# EAGLE design Simon-PTH (EAGLE 5.10)
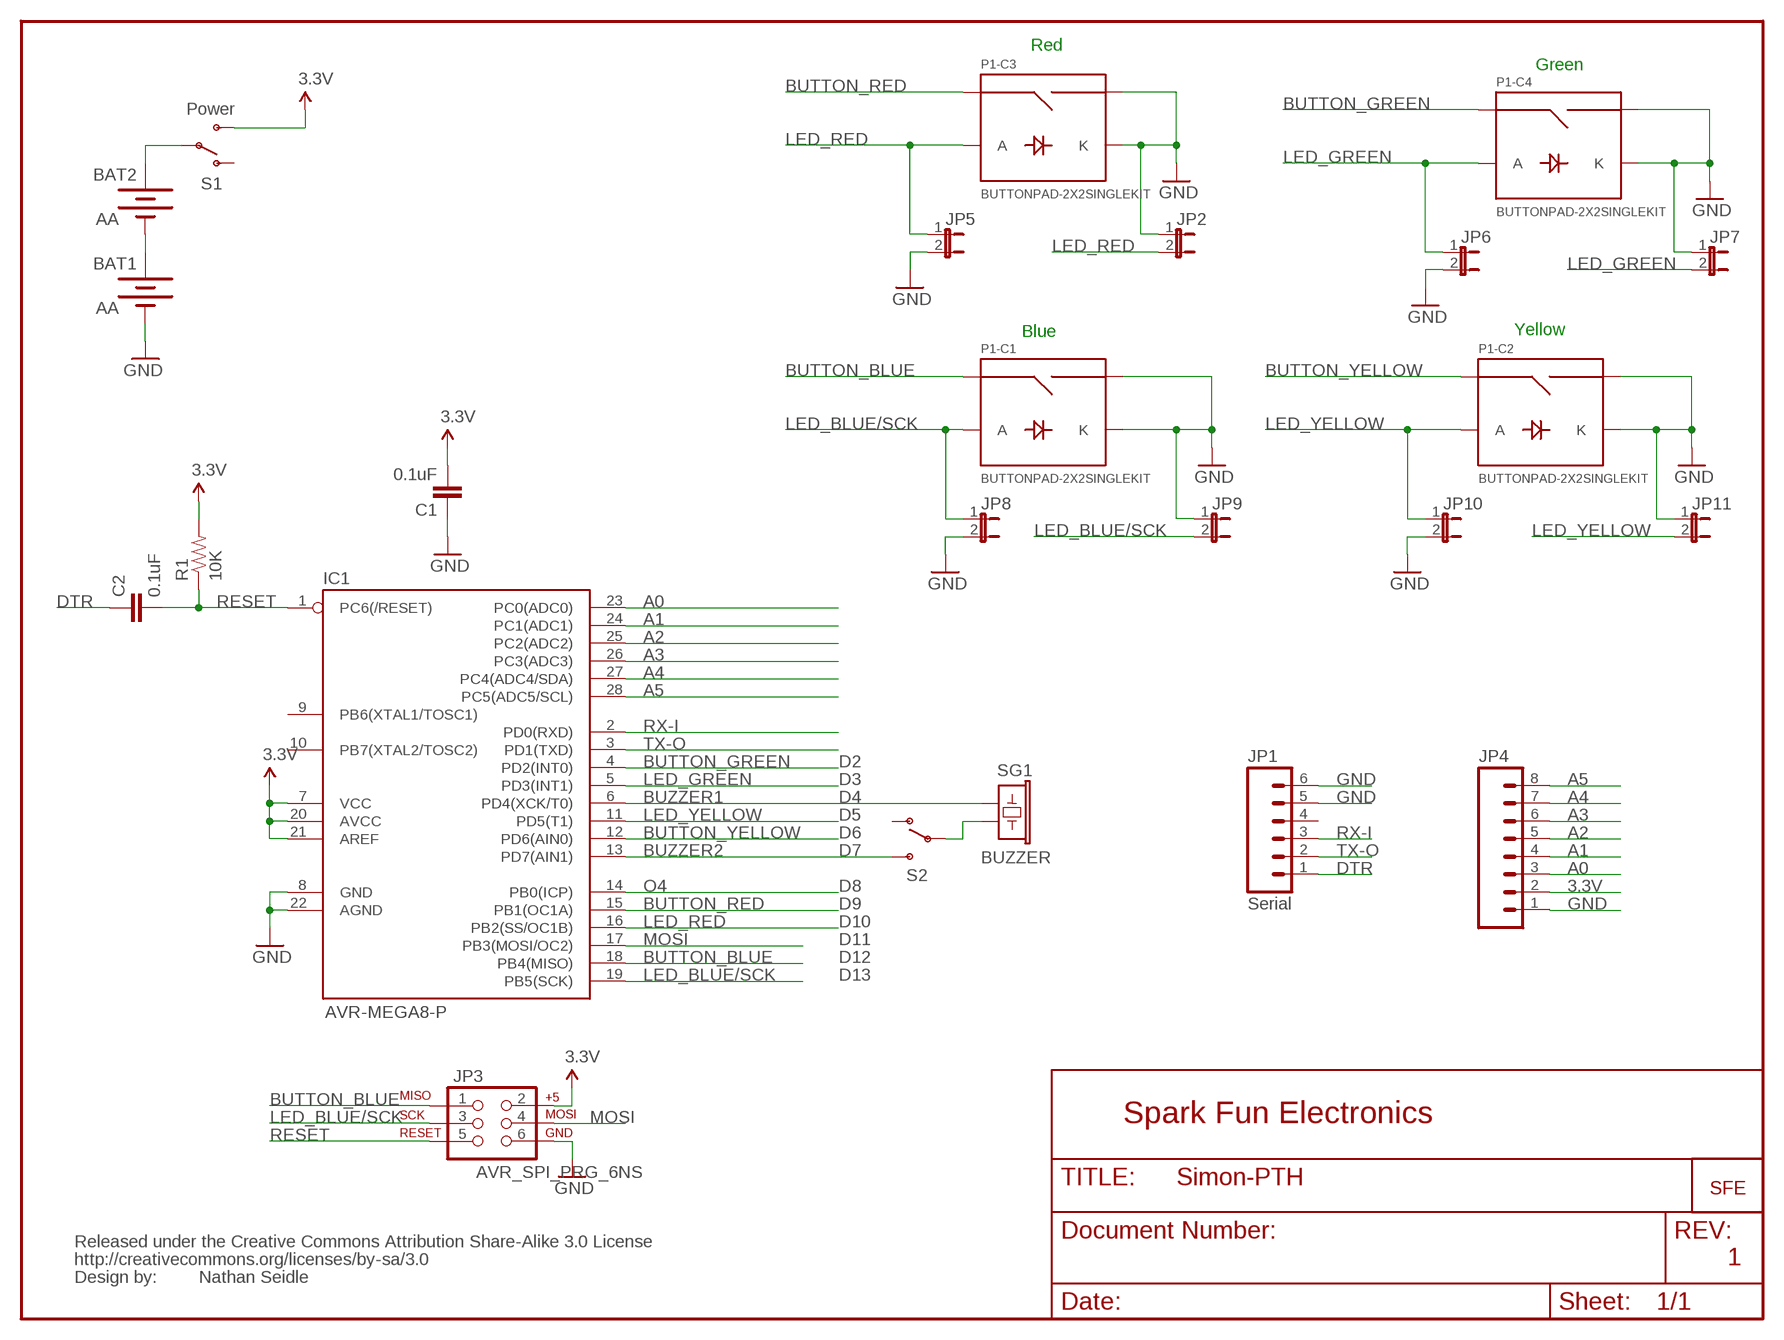
[diagram p0: schematic, sheet 1]

## Parts
BAT1  AA  BATTERYAA-KIT  [BATTERY-AA-KIT]
BAT2  AA  BATTERYAA-KIT  [BATTERY-AA-KIT]
C1  0.1uF  CAPCAP-PTH-SMALL-KIT  [CAP-PTH-SMALL-KIT]
C2  0.1uF  CAPCAP-PTH-SMALL-KIT  [CAP-PTH-SMALL-KIT]
IC1  AVR-MEGA8-P  AVR-MEGA8-PKIT  [DIL28-3-SIMON-KIT]
JP1  Serial  M06-SFENOSILK  [1X06-NOSILK]
JP2  JUMPER-2NOSILK  [SJ_2S_NO_SILK]
JP3  AVR_SPI_PRG_6NS  [2X3-NS]
JP4  M08NOSILK  [1X08NOSILK]
JP5  JUMPER-2NOSILK  [SJ_2S_NO_SILK]
JP6  JUMPER-2NOSILK  [SJ_2S_NO_SILK]
JP7  JUMPER-2NOSILK  [SJ_2S_NO_SILK]
JP8  JUMPER-2NOSILK  [SJ_2S_NO_SILK]
JP9  JUMPER-2NOSILK  [SJ_2S_NO_SILK]
JP10  JUMPER-2NOSILK  [SJ_2S_NO_SILK]
JP11  JUMPER-2NOSILK  [SJ_2S_NO_SILK]
P1-  BUTTONPAD-2X2SINGLEKIT  [BUTTONPAD-2X2SINGLE-KIT]
R1  10K  RESISTORAXIAL-0.3-KIT  [AXIAL-0.3-KIT]
S1  Power  SWITCH-SPSTKIT  [SWITCH-SPDT_KIT]
S2  SWITCH-SPSTKIT  [SWITCH-SPDT_KIT]
SG1  BUZZER  BUZZERKIT  [BUZZER-12MM-KIT]
U$1  LOGO-SFENEW  [SFE-NEW-WEBLOGO]
U$2  CREATIVE_COMMONS  [CREATIVE_COMMONS]

## Nets
3.3V: C1.2 IC1.7(VCC) IC1.20(AVCC) IC1.21(AREF) JP3.2 JP4.2 R1.P$2 S1.3(S)
A0: IC1.23(PC0(ADC0)) JP4.3
A1: IC1.24(PC1(ADC1)) JP4.4
A2: IC1.25(PC2(ADC2)) JP4.5
A3: IC1.26(PC3(ADC3)) JP4.6
A4: IC1.27(PC4(ADC4/SDA)) JP4.7
A5: IC1.28(PC5(ADC5/SCL)) JP4.8
BUTTON_BLUE [ButtonSignal]: IC1.18(PB4(MISO)) JP3.1 P1-.SIG1(C1:SIG1)
BUTTON_GREEN: IC1.4(PD2(INT0)) P1-.SIG7(C4:SIG1)
BUTTON_RED [ButtonSignal]: IC1.15(PB1(OC1A)) P1-.SIG5(C3:SIG1)
BUTTON_YELLOW [ButtonSignal]: IC1.12(PD6(AIN0)) P1-.SIG3(C2:SIG1)
BUZZER1: IC1.6(PD4(XCK/T0)) SG1.+
BUZZER2: IC1.13(PD7(AIN1)) S2.3(S)
DTR: C2.1 JP1.1
GND: BAT1.GND@1(-) C1.1 IC1.8(GND) IC1.22(AGND) JP1.5 JP1.6 JP2.1 JP3.6 JP4.1 JP5.2 JP6.2 JP7.1 JP8.2 JP9.1 JP10.2 JP11.1 P1-.K1(C1:K) P1-.K2(C2:K) P1-.K3(C3:K) P1-.K4(C4:K) P1-.SIG2(C1:SIG2) P1-.SIG4(C2:SIG2) P1-.SIG6(C3:SIG2) P1-.SIG8(C4:SIG2)
LED_BLUE/SCK: IC1.19(PB5(SCK)) JP3.3 JP8.1 JP9.2 P1-.A1(C1:A)
LED_GREEN: IC1.5(PD3(INT1)) JP6.1 JP7.2 P1-.A4(C4:A)
LED_RED: IC1.16(PB2(SS/OC1B)) JP2.2 JP5.1 P1-.A3(C3:A)
LED_YELLOW: IC1.11(PD5(T1)) JP10.1 JP11.2 P1-.A2(C2:A)
MOSI: IC1.17(PB3(MOSI/OC2)) JP3.4
N$2: BAT2.PWR@1(+) S1.2(P)
N$3: S2.2(P) SG1.-
N$4: BAT1.PWR@1(+) BAT2.GND@1(-)
O4 [ButtonSignal]: IC1.14(PB0(ICP))
RESET: C2.2 IC1.1(PC6(/RESET)) JP3.5 R1.P$1
RX-I: IC1.2(PD0(RXD)) JP1.3
TX-O: IC1.3(PD1(TXD)) JP1.2
Unconnected: IC1.9(PB6(XTAL1/TOSC1)) IC1.10(PB7(XTAL2/TOSC2)) JP1.4 S1.1(O) S2.1(O)

## Notes on the sheet
- Red
- Green
- Blue | Yellow
- D2
- D3
- D4
- D5
- D6
- D7
- D8
- D9
- D10
- D11
- D12
- D13
- Spark Fun Electronics
- 1
- Nathan Seidle

## Library data of the parts
BAT1 BAT2 = SparkFun:BATTERY: Battery Holders Various common sizes : AA, AAA, 20mm coin cell and 12mm coin cell.
C1 C2 = SparkFun:CAP: Capacitor Standard 0603 ceramic capacitor, and 0.1" leaded capacitor.
IC1 = Testing:AVR-MEGA8-P: MICROCONTROLLER 8 Kbytes FLASH 1 kbytes SRAM 512 bytes EEPROM USART 4-channel 10 bit ADC 2-channel 8 bit ADC
JP1 = unclepetes:M06-SFE: Header 6 Standard 6-pin 0.1" header. Use with straight break away headers (SKU : PRT-00116), right angle break away headers (PRT-00553), swiss pins (PRT-00743), machine pins (PRT-00117), and female headers (PRT-00115). Molex polarized connector foot print use with SKU : PRT-08094 with associated crimp pins and housings. NOTES ON THE VARIANTS LOCK and LOCK_LONGPADS... This footprint was designed to help hold the alignment of a through-hole component (i.e. 6-pin header) while soldering it into place. You may notice that each hole has been shifted either up or down by 0.005 of an inch from it's more standard position (which is a perfectly straight line). This slight alteration caused the pins (the squares in the middle) to touch the edges of the holes. Because they are alternating, it causes a "brace" to hold the component in place. 0.005 has proven to be the perfect amount of "off-center" position when using our standard breakaway headers. Although looks a little odd when you look at the bare footprint, once you have a header in there, the alteration is very hard to notice. Also, if you push a header all the way into place, it is covered up entirely on the bottom side. This idea of altering the position of holes to aid alignment will be further integrated into the Sparkfun Library for other footprints. It can help hold any component with 3 or more connection pins.
JP2 JP5-JP11 = unclepetes:JUMPER-2: Jumper Basic 0.1" spaced jumper. Use with breakaway headers.
JP3 = SparkFun:AVR_SPI_PRG_6: AVR ISP 6 Pin This is the reduced ISP connector for AVR programming. Common on Arduino. This footprint will take up less PCB space and can be used with a 10-pin to 6-pin adapter such as SKU: BOB-08508
JP4 = unclepetes:M08: Header 8 Standard 8-pin 0.1" header. Use with straight break away headers (SKU : PRT-00116), right angle break away headers (PRT-00553), swiss pins (PRT-00743), machine pins (PRT-00117), and female headers (PRT-00115).
P1- = SparkFun:BUTTONPAD-2X2SINGLE: 5mm Button Pad Proto layout and schematic for 2x2 button pad with single color LEDs (used on Simon board). Panelize this device/fp to a 4x4 pad if needed. Any single-color 5mm LED should be compatible. Spark Fun Electronics SKU : COM-07835.
R1 = SparkFun:RESISTOR: Resistor Basic schematic elements and footprints for 0603, 1206, and PTH resistors.
S1 S2 = SparkFun:SWITCH-SPST: SPST Switch Simple slide switch. Spark Fun Electronics SKU : COM-00102
SG1 = SparkFun:BUZZER: Buzzer 12mm Spark Fun Electronics SKU : Comp-Buzzer
U$1 = SparkFun:LOGO-SFE: Spark Fun Electronics PCB Logo This is the standard Spark Fun Electronics PCB logo.
U$2 = SparkFun:CREATIVE_COMMONS

## Net classes
0 Default: width 0.254 mm
1 Power: width 0.254 mm
3 ButtonSignal: width 0.254 mm

## Board
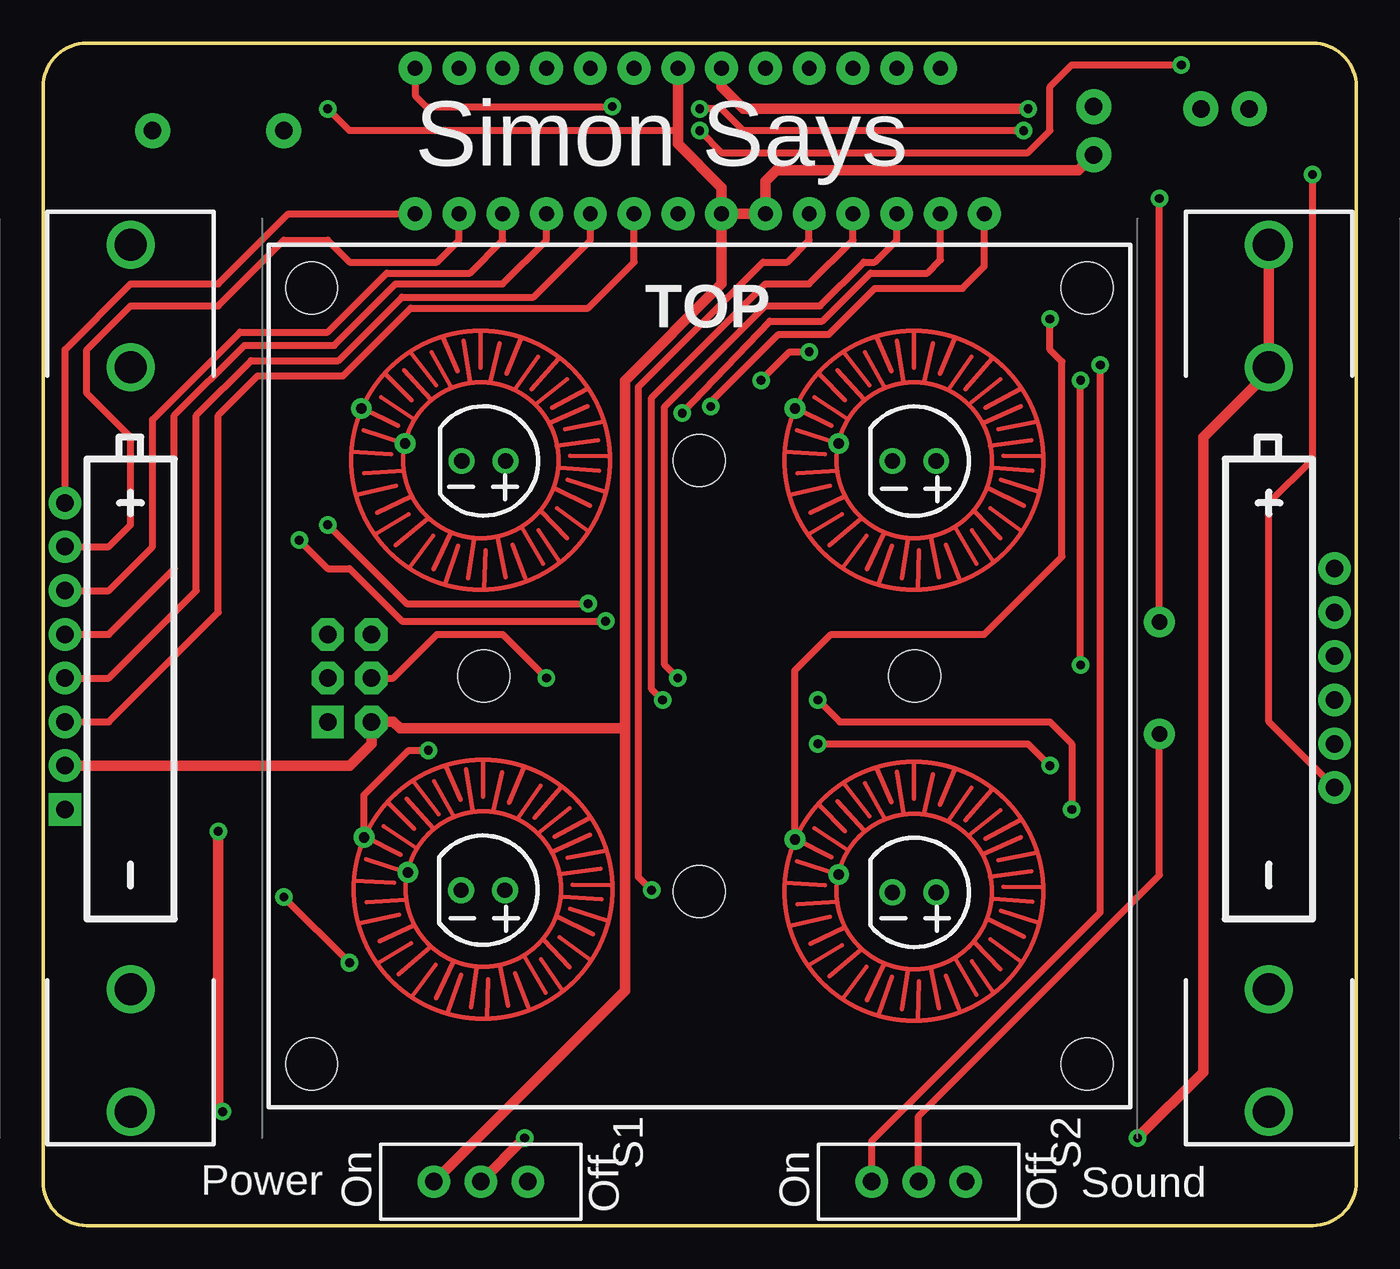
[diagram p1: board, top side]
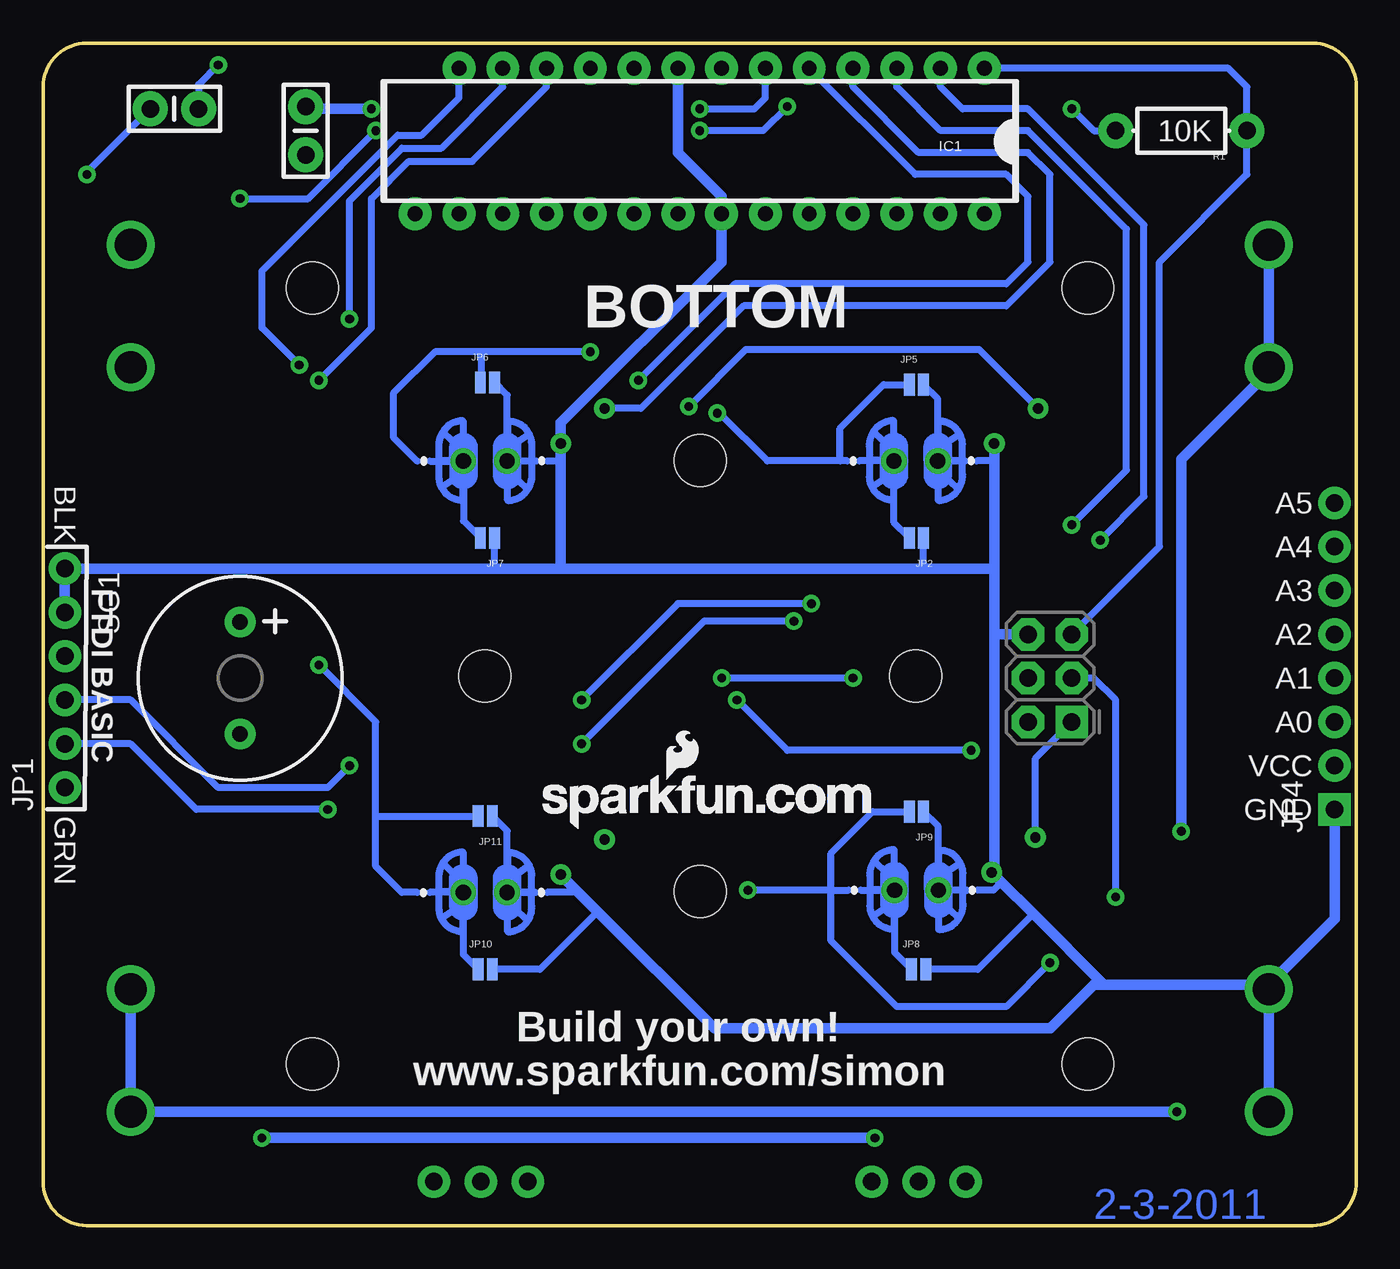
[diagram p2: board, bottom side, seen from below]

Size 76.2 x 68.58 mm. Coordinates in mm from the lower left corner, seen from the top.
Outline: 2.54,0 arc-90 0,2.54 0,66.04 arc-90 2.54,68.58 73.66,68.58 arc-90 76.2,66.04 76.2,2.54 arc-90 73.66,0 2.54,0
Copper layers (1*16): Top 0.035mm / dielectric 1.5mm / Bottom 0.035mm
Design rules "SparkFun *": minimum track width 10mil, minimum drill 20mil, track to track 8mil, track to pad 8mil, pad to pad 8mil, via to via 8mil, smd to smd 8mil, copper to edge 10mil, drill to drill 8mil, minimum pad ring 12mil, minimum via ring 10mil, stop-mask expansion 4mil, vias tented up to drill 25mil, thermal gap 10mil

### Footprints (pad centres in the part's own frame; a part is rotated, then mirrored left to right if it is on the bottom)
BATTERY-AA-KIT = drill 1.854 round: GND@1 25.146,0; GND@2 18.034,0; PWR@1 -25.146,0; PWR@2 -18.034,0
CAP-PTH-SMALL-KIT = drill 1.016 pad 2.032 round: 1 -0.127,0; 2 2.667,0
DIL28-3-SIMON-KIT = drill 0.864 pad 1.905 round: 1 -16.51,-4.255; 2 -13.97,-4.255; 3 -11.43,-4.255; 4 -8.89,-4.255; 5 -6.35,-4.255; 6 -3.81,-4.255; 7 -1.27,-4.255; 8 1.27,-4.255; 9 3.81,-4.255; 10 6.35,-4.255; 11 8.89,-4.255; 12 11.43,-4.255; 13 13.97,-4.255; 14 13.97,-4.255; 15 16.51,4.191; 16 13.97,4.191; 17 11.43,4.191; 18 8.89,4.191; 19 6.35,4.191; 20 3.81,4.191; 21 1.27,4.191; 22 -1.27,4.191; 23 -3.81,4.191; 24 -6.35,4.191; 25 -8.89,4.191; 26 -11.43,4.191; 27 -13.97,4.191; 28 -16.51,4.191
1X06-NOSILK = drill 1.016 pad 1.88 round: 1 0,0; 2 2.54,0; 3 5.08,0; 4 7.62,0; 5 10.16,0; 6 12.7,0
SJ_2S_NO_SILK = smd 0.635 x 1.27: 1 -0.412,0; 2 0.412,0
2X3-NS = drill 1.016 pad 1.88 square: 1 -2.54,-1.27 | drill 1.016 pad 1.88 octagon: 2 -2.54,1.27; 3 0,-1.27; 4 0,1.27; 5 2.54,-1.27; 6 2.54,1.27
1X08NOSILK = drill 1.016 pad 1.88 square: 1 0,0 | drill 1.016 pad 1.88 round: 2 2.54,0; 3 5.08,0; 4 7.62,0; 5 10.16,0; 6 12.7,0; 7 15.24,0; 8 17.78,0
BUTTONPAD-2X2SINGLE-KIT = drill 0.889 pad 1.016 round: A1 13.716,12.573; A2 38.735,12.446; A3 13.75,37.47; A4 38.735,37.465; K1 11.176,12.573; K2 36.195,12.446; K3 11.21,37.47; K4 36.195,37.465 | drill 0.6 round: SIG1 5.542,15.64; SIG2 8.082,13.608; SIG3 30.542,15.513; SIG4 33.082,13.481; SIG5 5.388,40.513; SIG6 7.928,38.481; SIG7 30.542,40.513; SIG8 33.082,38.481 | hole 3: 12.5,25; 25,37.5; 37.5,25; 25,12.5; 2.5,2.5; 2.5,47.5; 47.5,47.5; 47.5,2.5
AXIAL-0.3-KIT = drill 1.016 pad 2.032 round: P$1 -3.81,0; P$2 3.81,0
SWITCH-SPDT_KIT = drill 1.016 pad 1.88 round: 1 0,2.718; 2 0,0; 3 0,-2.718
BUZZER-12MM-KIT = drill 0.9 pad 1.778 round: + 3.25,0; - -3.25,0

### Placement (x,y rotation side)
BAT1  5.08,31.75 270 top
BAT2  71.12,31.75 270 top
C1  60.96,64.77 270 bottom
C2  69.85,64.77 0 bottom
IC1  38.1,62.87 180 bottom
JP1  74.93,25.4 90 bottom
JP2  25.53,39.88 180 bottom
JP3  17.78,31.75 90 bottom
JP4  1.27,24.13 90 bottom
JP5  25.53,48.77 0 bottom
JP6  50.42,48.9 0 bottom
JP7  50.42,39.88 180 bottom
JP8  25.4,14.86 0 bottom
JP9  25.53,24 180 bottom
JP10  50.55,14.86 0 bottom
JP11  50.55,23.75 180 bottom
P1-  13.08,6.87 0 top
R1  10.16,63.5 180 bottom
S1  25.4,2.54 270 top
S2  50.8,2.54 270 top
SG1  64.77,31.75 90 bottom
U$1  47.24,22.99 0 bottom
U$2  16.51,-16.51 0 top  (outside the outline)

### Tracks (layer width: path | path; a pad name or v marks a point on that pad's centre or on a via)
3.3V  (via drill 0.51)
  Top 0.406: 36.83,63.5 17.78,63.5 v16.51,64.77
  Top 0.61: IC1.7 36.83,63.5 36.83,62.74 39.37,60.2 IC1.21 | IC1.21 IC1.20 41.91,60.58 42.55,61.21 60.07,61.21 C1.2 | S1.3 33.76,13.61 33.76,28.83 | IC1.21 39.37,54.61 33.76,49 33.76,28.83 | 33.76,28.83 20.7,28.83 20.32,29.21 JP3.2 19.05,27.94 17.78,26.67 JP4.2
  Bottom 0.406: v16.51,64.77 15.24,63.5 R1.P$2
A0
  Top 0.406: IC1.23 34.29,55.88 31.62,53.21 21.34,53.21 17.4,49.28 12.45,49.28 10.16,46.99 10.16,35.56 3.81,29.21 JP4.3
A1
  Top 0.406: JP4.4 3.81,31.75 8.89,36.83 8.89,46.99 12.06,50.16 17.14,50.16 20.83,53.85 28.45,53.85 31.75,57.15 IC1.24
A2
  Top 0.406: JP4.5 3.81,34.29 7.62,38.1 7.62,46.99 11.68,51.05 16.89,51.05 20.45,54.61 26.67,54.61 29.21,57.15 IC1.25
A3
  Top 0.406: JP4.6 3.81,36.83 6.35,39.37 6.35,46.74 11.43,51.82 16.51,51.82 19.94,55.24 24.77,55.24 26.67,57.15 IC1.26
A4
  Top 0.406: JP4.7 3.81,39.37 5.08,40.64 5.08,45.72 2.54,48.26 2.54,50.8 5.08,53.34 10.16,53.34 13.97,57.15 16.51,57.15 17.78,55.88 22.86,55.88 24.13,57.15 IC1.27
A5
  Top 0.406: JP4.8 1.27,50.8 5.08,54.61 10.16,54.61 14.22,58.67 IC1.28
BUTTON_BLUE  (via drill 0.51)
  Top 0.406: v35.94,30.48 35.31,31.11 35.31,48.01 41.91,54.61 44.45,54.61 46.99,57.15 IC1.18 | P1-.SIG1 18.62,24.97 21.21,27.56 v22.35,27.56
  Bottom 0.406: JP3.1 18.62,27.1 P1-.SIG1 | v35.94,30.48 33.02,27.56 v22.35,27.56
BUTTON_GREEN
  Bottom 0.406: IC1.4 29.21,66.04 25.4,62.23 19.05,62.23 17.78,60.96 17.78,55.88 20.32,53.34 35.56,53.34 41.51,47.39 P1-.SIG7
BUTTON_RED  (via drill 0.51)
  Top 0.406: IC1.15 54.61,55.63 53.34,54.36 48.26,54.36 45.59,51.69 42.67,51.69 38.73,47.75 v38.73,47.5
  Bottom 0.406: P1-.SIG5 21.88,50.8 35.43,50.8 v38.73,47.5
BUTTON_YELLOW  (via drill 0.51)
  Top 0.406: P1-.SIG3 43.62,32.19 45.72,34.29 54.61,34.29 59.12,38.8 59.12,50.1 58.42,50.8 v58.42,52.58
  Bottom 0.406: IC1.12 49.53,66.04 53.09,62.48 55.37,62.48 58.42,59.44 v58.42,52.58
BUZZER1  (via drill 0.51)
  Top 0.406: v38.1,64.77 39.37,64.77 40.64,63.5 v56.9,63.5 | SG1.+ v64.77,59.56
  Bottom 0.406: IC1.6 34.29,65.41 34.92,64.77 v38.1,64.77 | v56.9,63.5 60.83,59.56 v64.77,59.56
BUZZER2  (via drill 0.51)
  Top 0.406: S2.3 48.08,4.9 61.34,18.16 v61.34,49.91
  Bottom 0.406: IC1.13 52.07,65.41 54.23,63.25 55.63,63.25 63.5,55.37 63.5,52.07 v61.34,49.91
DTR  (via drill 0.51)
  Top 0.406: v73.66,60.96 73.66,44.45 71.12,41.91 71.12,29.21 JP1.1
  Bottom 0.406: v73.66,60.96 73.66,61.09 C2.1
GND  (via drill 0.51)
  Top 0.61: IC1.8 39.37,66.04 40.64,64.77 v57.15,64.77
  Bottom 0.254: 46.94,44.34 47.59,44.34 arc90 47.55,44.34 | 22.69,44.34 22.17,44.34 arc90 22.16,44.34 22.02,44.34 | 22.62,19.44 22.19,19.44 21.97,19.45 | 46.96,19.32 47.62,19.32
  Bottom 0.406: 46.16,45.28 P1-.SIG8 | P1-.K3 24.02,44.34 | P1-.K3 24.29,47.94 JP5.2 | JP2.1 25.11,38.38 25.4,38.1 | P1-.K3 22.7,44.34 arc90 22.69,44.34 | JP7.1 50.01,38.1 49.53,38.1 | JP6.2 49.28,48.16 P1-.K4 47.59,44.34 | 22.02,44.34 21.01,44.34 21.01,44.45 | 46.94,44.34 46.16,44.34 46.16,44.45 | JP9.1 24.26,23.14 P1-.K1 22.63,19.45 22.62,19.44 | JP8.2 21.97,14.86 18.76,18.07 | 21.97,19.45 21.05,19.45 20.59,19.91 | JP11.1 49.28,22.89 P1-.K2 47.62,19.32 | JP10.2 47.37,14.86 44.02,18.21 | 46.96,19.32 45.15,19.32 45.15,19.34
  Bottom 0.61: JP1.5 JP1.6 49.53,38.1 46.16,38.1 | P1-.SIG8 46.16,46.55 36.83,55.88 IC1.22 36.83,59.69 39.37,62.23 IC1.8 | 21.01,34.29 21.01,20.64 P1-.SIG2 20.59,19.91 18.76,18.07 14.65,13.97 | 21.01,34.29 21.01,38.1 | 21.01,38.1 21.01,44.45 P1-.SIG6 | 21.01,34.29 JP3.6 | 46.16,38.1 46.16,44.45 46.16,45.28 | P1-.SIG4 45.15,19.34 44.02,18.21 37.24,11.43 36.83,11.45 17.76,11.45 15.24,13.97 14.65,13.97 | JP4.1 1.27,17.78 5.08,13.97 | 21.01,38.1 25.4,38.1 46.16,38.1 | BAT1.GND@1 5.08,13.97 | v57.15,64.77 60.83,64.77 C1.1 | 5.08,13.97 13.97,13.97 14.65,13.97
LED_BLUE/SCK  (via drill 0.51)
  Top 0.406: IC1.19 44.45,57.15 43.18,55.88 41.78,55.88 34.54,48.64 34.54,20.21 v35.3,19.45 | v13.97,19.05 v17.78,15.24
  Bottom 0.254: 28.77,19.45 29.47,19.45
  Bottom 0.406: 30.48,19.45 29.47,19.45 | 30.48,19.45 v35.3,19.45 | JP3.3 15.24,31.75 13.97,30.48 v13.97,19.05 | 30.48,19.45 30.48,16.51 26.67,12.7 20.32,12.7 v17.78,15.24 | JP9.2 28.07,24 30.48,21.59 30.48,19.45 | 28.77,19.45 P1-.A1 26.8,15.84 JP8.1
LED_GREEN  (via drill 0.51)
  Top 0.406: v44.45,50.67 43.31,50.67 v41.66,49.02
  Bottom 0.254: 53.75,44.34 54.5,44.34
  Bottom 0.406: IC1.5 25.59,60.96 20.32,60.96 19.05,59.69 19.05,55.88 20.32,54.61 36.07,54.61 v41.66,49.02 | v44.45,50.67 50.8,50.67 | 50.8,50.67 53.47,50.67 55.88,48.26 55.88,45.72 54.5,44.34 | JP7.2 51.82,40.86 P1-.A4 53.75,44.34 | JP6.1 50.8,48.93 50.8,50.67
LED_RED  (via drill 0.51)
  Top 0.406: IC1.16 52.07,56.01 51.31,55.24 48.01,55.24 45.21,52.45 42.16,52.45 v37.08,47.12
  Bottom 0.254: 28.85,44.34 29.54,44.34 29.54,44.35
  Bottom 0.406: v37.08,47.12 36.96,46.99 36.83,46.99 34.18,44.34 29.96,44.34 | JP5.1 27.43,48.77 29.96,46.24 29.96,44.34 | JP2.2 26.83,40.77 P1-.A3 28.85,44.34 | 29.54,44.35 29.96,44.35 arc-90 29.96,44.34
LED_YELLOW  (via drill 0.51)
  Top 0.406: v60.2,32.51 v60.2,49.02
  Bottom 0.254: 53.76,19.32 54.43,19.32 54.48,19.32
  Bottom 0.406: IC1.11 46.99,66.04 51.31,61.72 54.99,61.72 57.15,59.56 57.15,52.07 v60.2,49.02 | v60.2,32.51 56.9,29.21 56.9,23.75 | 54.48,19.32 55.39,19.32 56.9,20.83 56.9,23.75 | JP10.1 51.82,15.72 P1-.A2 53.76,19.32 | 56.9,23.75 JP11.2
MOSI  (via drill 0.51)
  Top 0.406: v36.83,31.75 36.07,32.51 36.07,47.5 41.91,53.34 45.09,53.34 47.62,55.88 48.26,55.88 49.53,57.15 IC1.17 | v29.21,31.75 26.67,34.29 22.86,34.29 20.32,31.75 JP3.4
  Bottom 0.406: v29.21,31.75 v36.83,31.75
N$2  (via drill 0.51)
  Top 0.61: v63.5,5.08 67.31,8.89 67.31,45.72 71.12,49.53 BAT2.PWR@1 | S1.2 v27.94,5.08
  Bottom 0.61: v27.94,5.08 v63.5,5.08
N$3
  Top 0.406: SG1.- 64.77,20.32 50.8,6.35 S2.2
N$4  (via drill 0.51)
  Top 0.61: v10.16,22.86 10.16,6.86 v10.41,6.6
  Bottom 0.61: v10.41,6.6 BAT2.GND@1 71.12,13.97 | v10.16,22.86 10.16,44.45 5.08,49.53 BAT1.PWR@1
RESET  (via drill 0.51)
  Top 0.406: IC1.1 21.59,65.53 22.23,64.9 v33.02,64.9 | v66.04,67.31 59.69,67.31 58.42,66.04 58.42,63.5 57.15,62.23 39.37,62.23 v38.1,63.5
  Bottom 0.406: JP3.5 11.43,39.37 11.43,55.88 6.35,60.96 R1.P$1 6.35,66.04 7.43,67.12 IC1.1 21.4,67.12 | v38.1,63.5 34.42,63.5 v33.02,64.9 | v66.04,67.31 67.18,66.17 C2.2
RX-I  (via drill 0.51)
  Top 0.406: v32.64,35.05 20.83,35.05 17.78,38.1 16.51,38.1 v14.86,39.75 | v44.96,27.94 57.15,27.94 v58.42,26.67
  Bottom 0.406: IC1.2 24.13,66.04 22.86,64.77 19.05,64.77 12.32,58.04 12.32,42.29 v14.86,39.75 | v58.42,26.67 59.69,25.4 66.04,25.4 71.12,30.48 JP1.3 | v32.64,35.05 37.85,35.05 v44.96,27.94
TX-O  (via drill 0.51)
  Top 0.406: v16.51,40.64 21.08,36.07 v31.62,36.07 | v59.69,24.13 59.69,27.94 58.42,29.21 46.23,29.21 v44.96,30.48
  Bottom 0.406: IC1.3 26.67,66.04 24.13,63.5 19.05,63.5 13.34,57.78 13.34,43.81 v16.51,40.64 | JP1.2 71.12,27.94 67.31,24.13 v59.69,24.13 | v31.62,36.07 39.37,36.07 v44.96,30.48

### Text on the board
Bottom: 2-3-2011
tPlace: Simon Says | TOP | Power | Sound | On | Off | On | Off
bPlace: BOTTOM | A5 | BLK | A4 | A3 | FTDI BASIC | A2 | A1 | A0 | VCC | GND | GRN | Build your own! | www.sparkfun.com/simon
tValues: Clip | All thru hole components make joint on bottom
bValues: All thru hole components make joint on top side